# EAGLE schematic garden_raspberry (EAGLE 9.0.0)
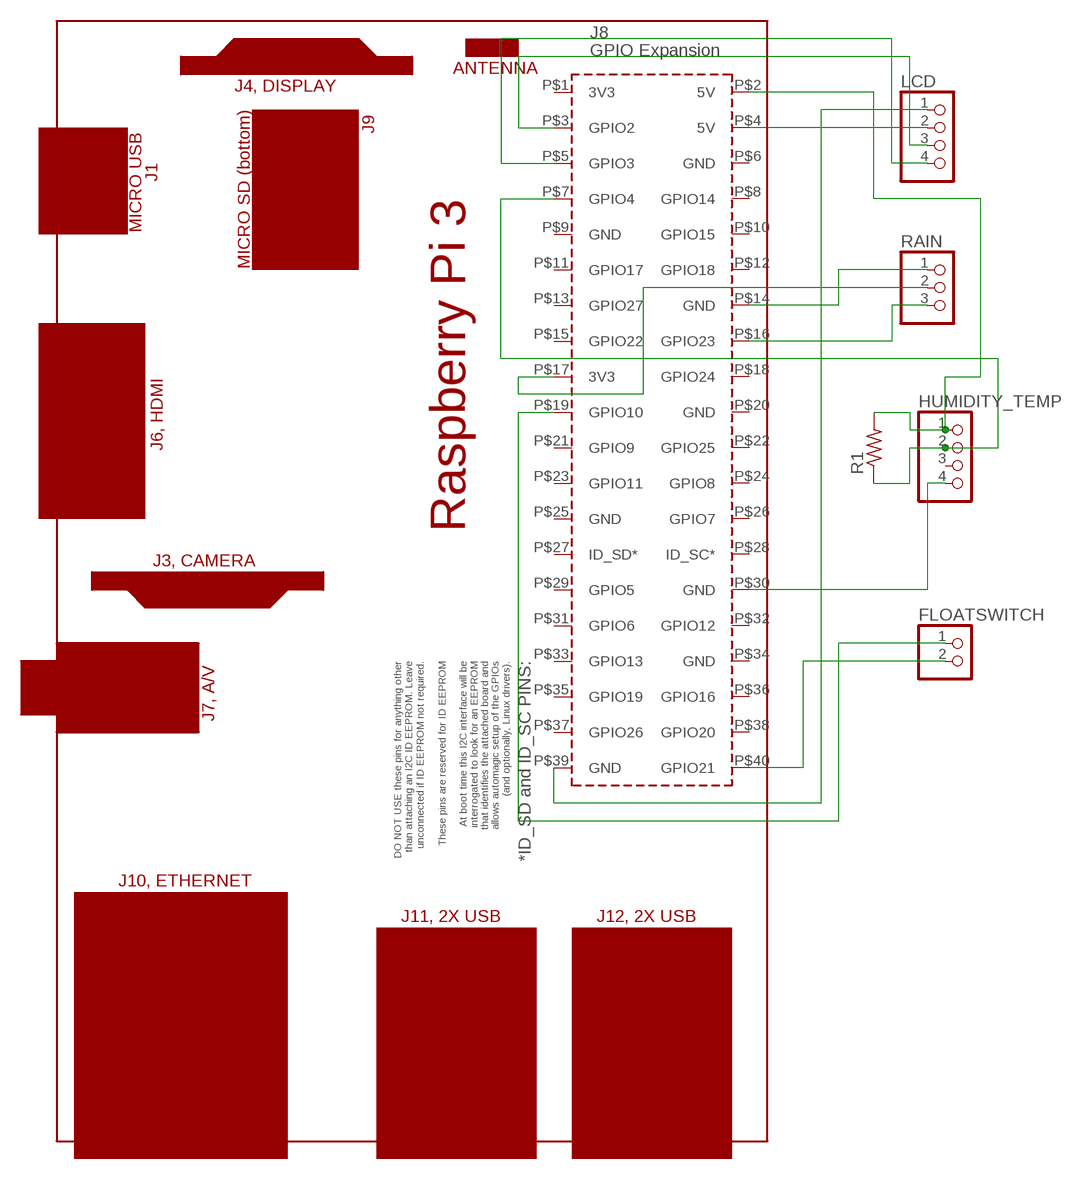
[diagram p0: schematic, sheet 1]

## Parts
FLOATSWITCH  PINHD-1X2  [1X02]
HUMIDITY_TEMP  PINHD-1X4  [1X04]
LCD  PINHD-1X4  [1X04]
PCB1  RPI3RPI3  [RPI3]
R1  R-US_0204/7  [0204/7]
RAIN  PINHD-1X3  [1X03]

## Nets
N$1: LCD.1 PCB1.P$39(GND)
N$2: LCD.2 PCB1.P$4(5V)
N$3: LCD.3 PCB1.P$3(GPIO2)
N$4: LCD.4 PCB1.P$5(GPIO3)
N$5: PCB1.P$17(3V3) RAIN.2
N$6: PCB1.P$14(GND) RAIN.1
N$7: PCB1.P$16(GPIO23) RAIN.3
N$8: HUMIDITY_TEMP.1 PCB1.P$2(5V) R1.2
N$9: FLOATSWITCH.1 PCB1.P$19(GPIO10)
N$10: HUMIDITY_TEMP.2 PCB1.P$7(GPIO4) R1.1
N$11: HUMIDITY_TEMP.4 PCB1.P$30(GND)
N$12: FLOATSWITCH.2 PCB1.P$40(GPIO21)
Unconnected: HUMIDITY_TEMP.3 PCB1.P$1(3V3) PCB1.P$6(GND) PCB1.P$8(GPIO14) PCB1.P$9(GND) PCB1.P$10(GPIO15) PCB1.P$11(GPIO17) PCB1.P$12(GPIO18) PCB1.P$13(GPIO27) PCB1.P$15(GPIO22) PCB1.P$18(GPIO24) PCB1.P$20(GND) PCB1.P$21(GPIO9) PCB1.P$22(GPIO25) PCB1.P$23(GPIO11) PCB1.P$24(GPIO8) PCB1.P$25(GND) PCB1.P$26(GPIO7) PCB1.P$27(ID_SD*) PCB1.P$28(ID_SC*) PCB1.P$29(GPIO5) PCB1.P$31(GPIO6) PCB1.P$32(GPIO12) PCB1.P$33(GPIO13) PCB1.P$34(GND) PCB1.P$35(GPIO19) PCB1.P$36(GPIO16) PCB1.P$37(GPIO26) PCB1.P$38(GPIO20)

## Library data of the parts
FLOATSWITCH = pinhead:PINHD-1X2: PIN HEADER
HUMIDITY_TEMP LCD = pinhead:PINHD-1X4: PIN HEADER
PCB1 = e14_Rpi3_RevA+mirror-pcb:RPI3: Device for Raspberry Pi 3 board created by Dave Young for www.element14.com More information and support community is available at https://www.element14.com/community/community/raspberry-pi Device for Raspberry Pi 3 board updated by Gerald Schwarz for www.element14.com On RPI3 addet the layer milling and created a mirrored shield.
R1 = adafruit:R-US_: RESISTOR, American symbol
RAIN = pinhead:PINHD-1X3: PIN HEADER